# Altium schematic sheet Sheet2.SchDoc
size A3
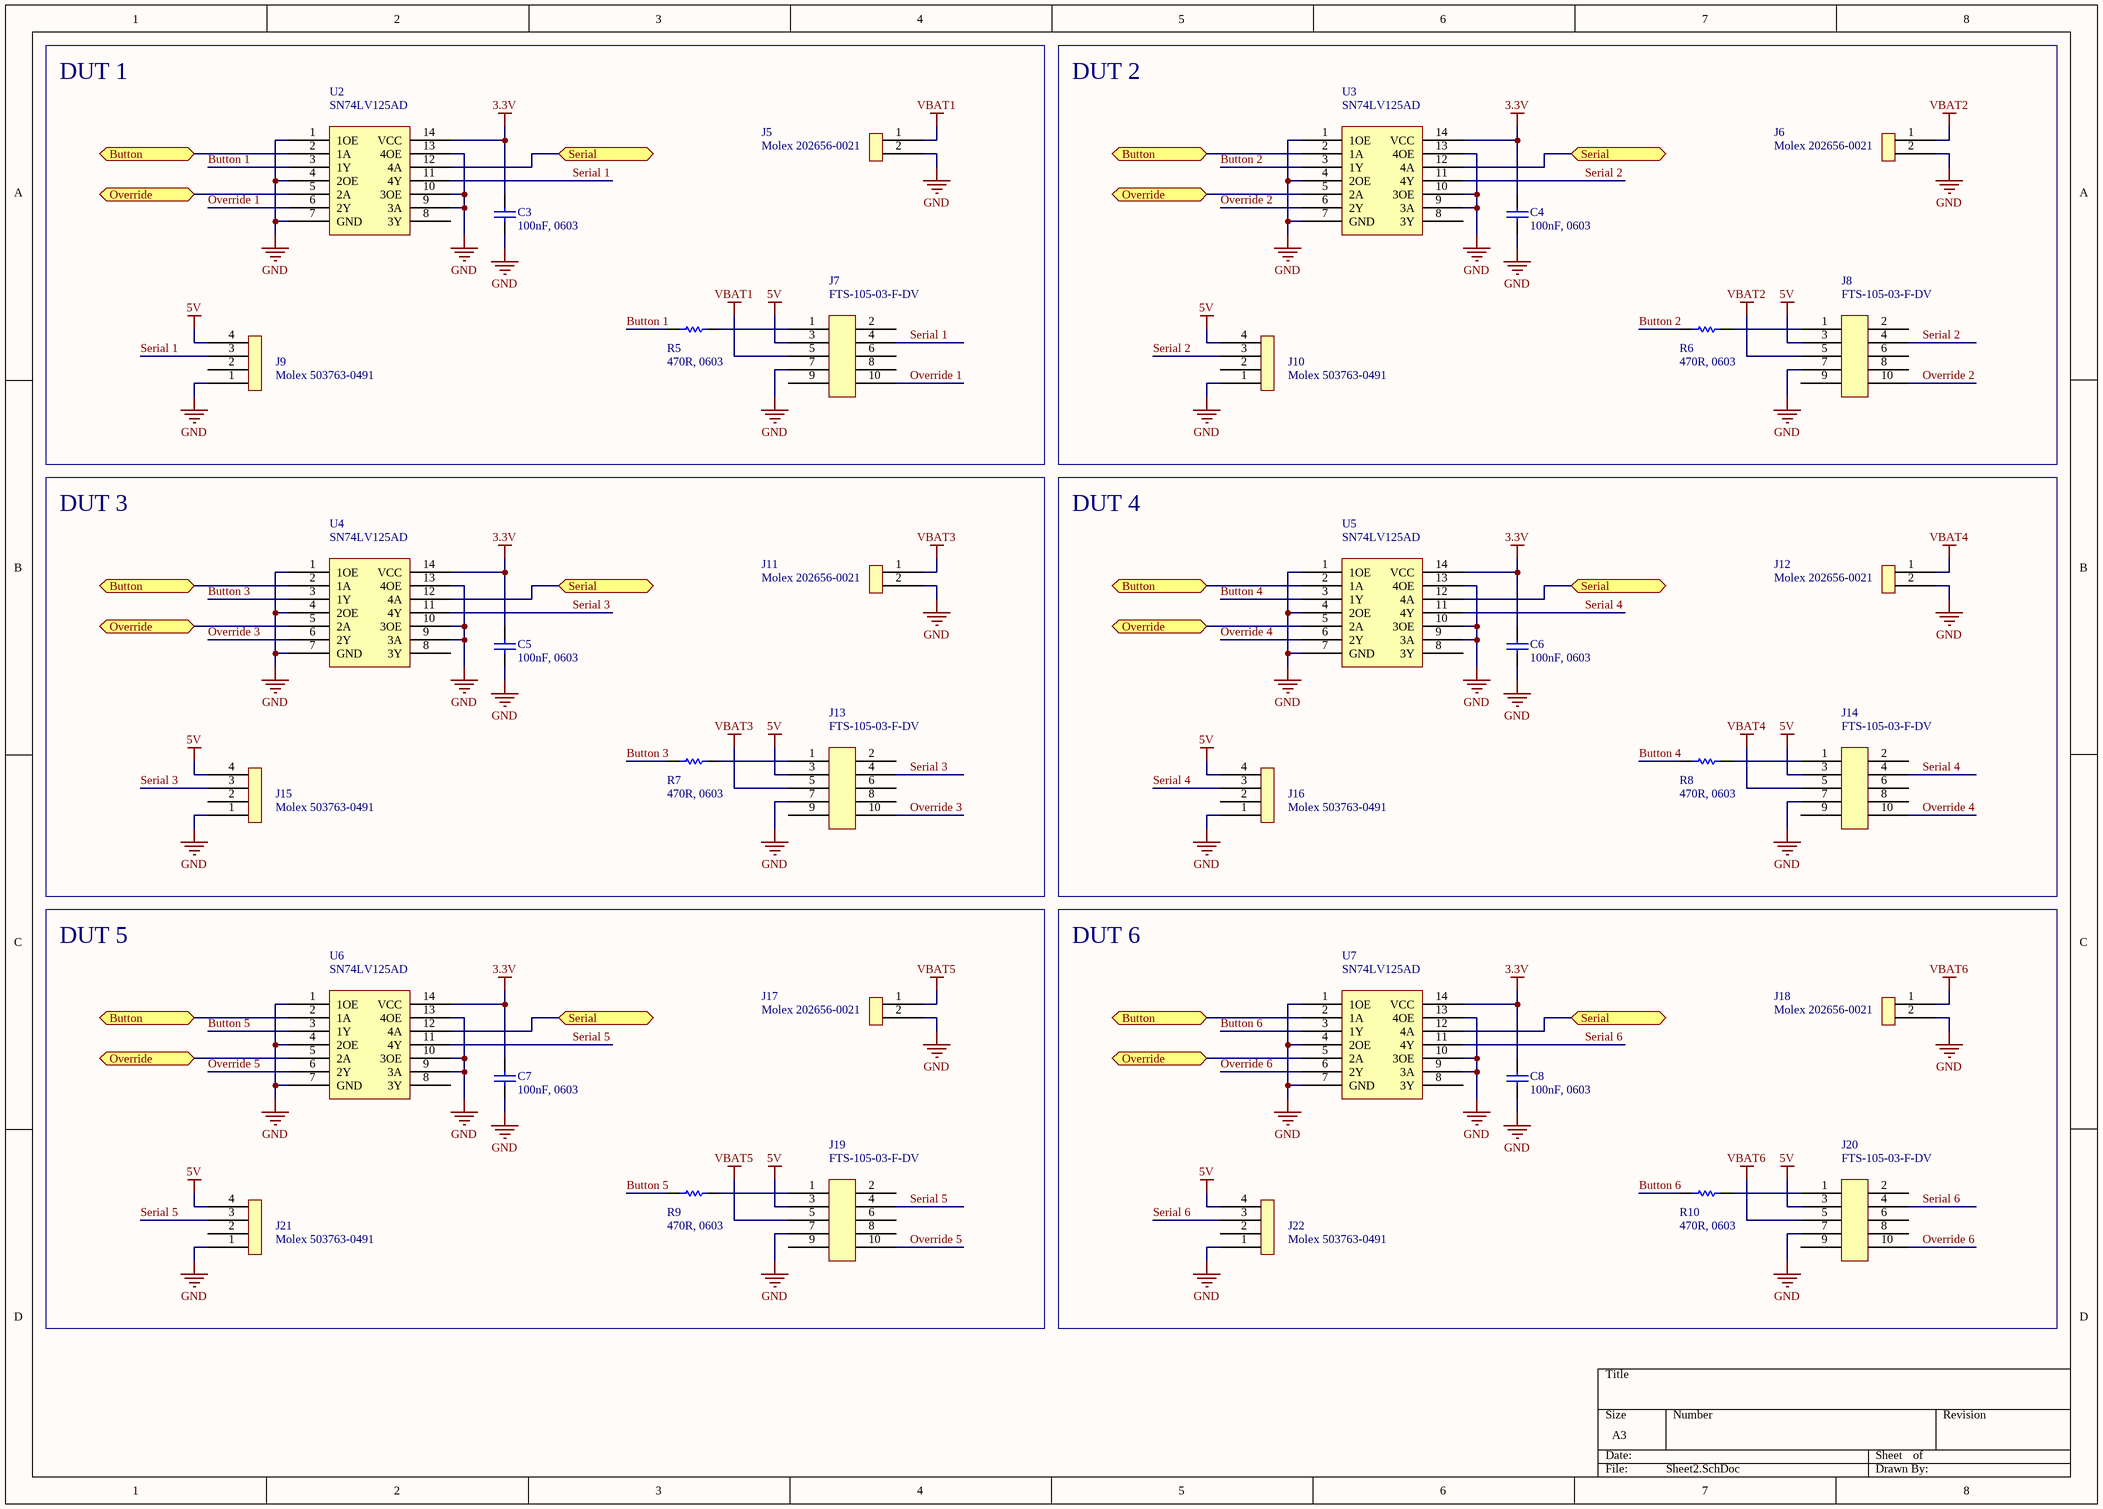
[diagram p0: Sheet2.SchDoc]

## Parts
C3  100nF, 0603  [Capacitor 0603]
C4  100nF, 0603  [Capacitor 0603]
C5  100nF, 0603  [Capacitor 0603]
C6  100nF, 0603  [Capacitor 0603]
C7  100nF, 0603  [Capacitor 0603]
C8  100nF, 0603  [Capacitor 0603]
J5  Molex 202656-0021  [Molex 202656-0021]
J6  Molex 202656-0021  [Molex 202656-0021]
J7  FTS-105-03-F-DV  [FTS-105-03-F-DV]
J8  FTS-105-03-F-DV  [FTS-105-03-F-DV]
J9  Molex 503763-0491  [Molex 503763-0491]
J10  Molex 503763-0491  [Molex 503763-0491]
J11  Molex 202656-0021  [Molex 202656-0021]
J12  Molex 202656-0021  [Molex 202656-0021]
J13  FTS-105-03-F-DV  [FTS-105-03-F-DV]
J14  FTS-105-03-F-DV  [FTS-105-03-F-DV]
J15  Molex 503763-0491  [Molex 503763-0491]
J16  Molex 503763-0491  [Molex 503763-0491]
J17  Molex 202656-0021  [Molex 202656-0021]
J18  Molex 202656-0021  [Molex 202656-0021]
J19  FTS-105-03-F-DV  [FTS-105-03-F-DV]
J20  FTS-105-03-F-DV  [FTS-105-03-F-DV]
J21  Molex 503763-0491  [Molex 503763-0491]
J22  Molex 503763-0491  [Molex 503763-0491]
R5  470R, 0603  [Resistor 0603]
R6  470R, 0603  [Resistor 0603]
R7  470R, 0603  [Resistor 0603]
R8  470R, 0603  [Resistor 0603]
R9  470R, 0603  [Resistor 0603]
R10  470R, 0603  [Resistor 0603]
U2  SN74LV125AD  [SOIC-14]
U3  SN74LV125AD  [SOIC-14]
U4  SN74LV125AD  [SOIC-14]
U5  SN74LV125AD  [SOIC-14]
U6  SN74LV125AD  [SOIC-14]
U7  SN74LV125AD  [SOIC-14]

## Blocks framed on the sheet
DUT 1: C3 J5 J7 J9 R5 U2
DUT 2: C4 J6 J8 J10 R6 U3
DUT 3: C5 J11 J13 J15 R7 U4
DUT 4: C6 J12 J14 J16 R8 U5
DUT 5: C7 J17 J19 J21 R9 U6
DUT 6: C8 J18 J20 J22 R10 U7

## Ports
Button, Override, Serial

## Nets
3.3V: C3.2 C4.2 C5.2 C6.2 C7.2 C8.2 U2.14(VCC) U3.14(VCC) U4.14(VCC) U5.14(VCC) U6.14(VCC) U7.14(VCC)
5V: J7.3 J8.3 J9.4 J10.4 J13.3 J14.3 J15.4 J16.4 J19.3 J20.3 J21.4 J22.4
GND: C3.1 C4.1 C5.1 C6.1 C7.1 C8.1 J5.2 J6.2 J7.7 J8.7 J9.1 J10.1 J11.2 J12.2 J13.7 J14.7 J15.1 J16.1 J17.2 J18.2 J19.7 J20.7 J21.1 J22.1 U2.1(1OE) U2.4(2OE) U2.7(GND) U2.9(3A) U2.10(3OE) U2.13(4OE) U3.1(1OE) U3.4(2OE) U3.7(GND) U3.9(3A) U3.10(3OE) U3.13(4OE) U4.1(1OE) U4.4(2OE) U4.7(GND) U4.9(3A) U4.10(3OE) U4.13(4OE) U5.1(1OE) U5.4(2OE) U5.7(GND) U5.9(3A) U5.10(3OE) U5.13(4OE) U6.1(1OE) U6.4(2OE) U6.7(GND) U6.9(3A) U6.10(3OE) U6.13(4OE) U7.1(1OE) U7.4(2OE) U7.7(GND) U7.9(3A) U7.10(3OE) U7.13(4OE)
VBAT1: J5.1 J7.5
VBAT2: J6.1 J8.5
VBAT3: J11.1 J13.5
VBAT4: J12.1 J14.5
VBAT5: J17.1 J19.5
VBAT6: J18.1 J20.5
Button: U2.2(1A) U3.2(1A) U4.2(1A) U5.2(1A) U6.2(1A) U7.2(1A) ; port Button
Button 1: R5.1 U2.3(1Y)
Button 2: R6.1 U3.3(1Y)
Button 3: R7.1 U4.3(1Y)
Button 4: R8.1 U5.3(1Y)
Button 5: R9.1 U6.3(1Y)
Button 6: R10.1 U7.3(1Y)
Override: U2.5(2A) U3.5(2A) U4.5(2A) U5.5(2A) U6.5(2A) U7.5(2A) ; port Override
Override 1: J7.10 U2.6(2Y)
Override 2: J8.10 U3.6(2Y)
Override 3: J13.10 U4.6(2Y)
Override 4: J14.10 U5.6(2Y)
Override 5: J19.10 U6.6(2Y)
Override 6: J20.10 U7.6(2Y)
Serial: U2.12(4A) U3.12(4A) U4.12(4A) U5.12(4A) U6.12(4A) U7.12(4A) ; port Serial
Serial 1: J7.4 J9.3 U2.11(4Y)
Serial 2: J8.4 J10.3 U3.11(4Y)
Serial 3: J13.4 J15.3 U4.11(4Y)
Serial 4: J14.4 J16.3 U5.11(4Y)
Serial 5: J19.4 J21.3 U6.11(4Y)
Serial 6: J20.4 J22.3 U7.11(4Y)
NetJ7_1: J7.1 R5.2
NetJ8_1: J8.1 R6.2
NetJ13_1: J13.1 R7.2
NetJ14_1: J14.1 R8.2
NetJ19_1: J19.1 R9.2
NetJ20_1: J20.1 R10.2

Not connected (* = marked no-connect by the designer): J7 2(*) 6(*) 8(*) 9(*); J8 2(*) 6(*) 8(*) 9(*); J9 2; J10 2; J13 2(*) 6(*) 8(*) 9(*); J14 2(*) 6(*) 8(*) 9(*); J15 2; J16 2; J19 2(*) 6(*) 8(*) 9(*); J20 2(*) 6(*) 8(*) 9(*); J21 2; J22 2; U2 8(3Y); U3 8(3Y); U4 8(3Y); U5 8(3Y); U6 8(3Y); U7 8(3Y)

## Library data of the parts
C3-C8 = Capacitor
R5-R10 = Resistor
U2-U7 = SN74LVC125AD